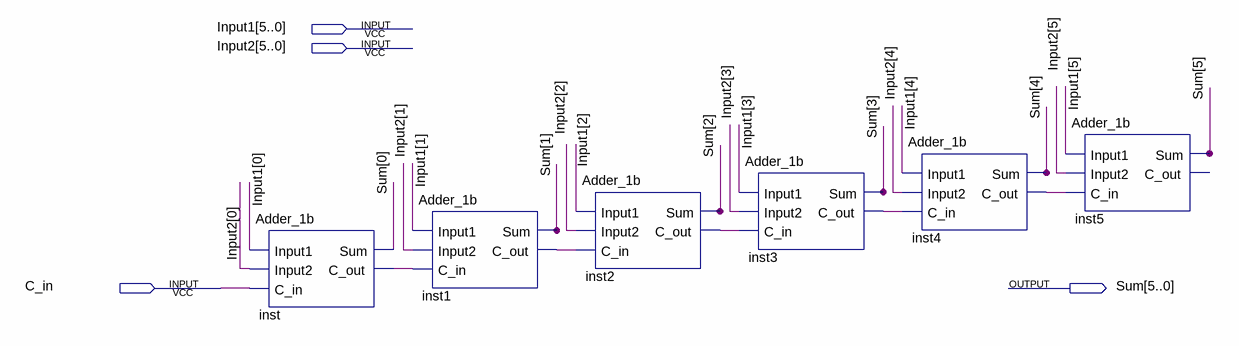
[diagram p0: schematic sheet]
// Quartus schematic Adder_6b.bdf as structural Verilog: 6 symbols, 4 pins
module Adder_6b (
  input  [5:0] Input1,
  input  [5:0] Input2,
  input  C_in,
  output [5:0] Sum
);

  wire inst1_c_out, inst2_c_out, inst3_c_out, inst4_c_out, inst_c_out;

  Adder_1b inst (.Input1(Input1[0]), .Input2(Input2[0]), .C_in(C_in), .Sum(Sum[0]), .C_out(inst_c_out));
  Adder_1b inst1 (.Input1(Input1[1]), .Input2(Input2[1]), .C_in(inst_c_out), .Sum(Sum[1]), .C_out(inst1_c_out));
  Adder_1b inst2 (.Input1(Input1[2]), .Input2(Input2[2]), .C_in(inst1_c_out), .Sum(Sum[2]), .C_out(inst2_c_out));
  Adder_1b inst3 (.Input1(Input1[3]), .Input2(Input2[3]), .C_in(inst2_c_out), .Sum(Sum[3]), .C_out(inst3_c_out));
  Adder_1b inst4 (.Input1(Input1[4]), .Input2(Input2[4]), .C_in(inst3_c_out), .Sum(Sum[4]), .C_out(inst4_c_out));
  Adder_1b inst5 (.Input1(Input1[5]), .Input2(Input2[5]), .C_in(inst4_c_out), .Sum(Sum[5]));  // open: C_out
endmodule
